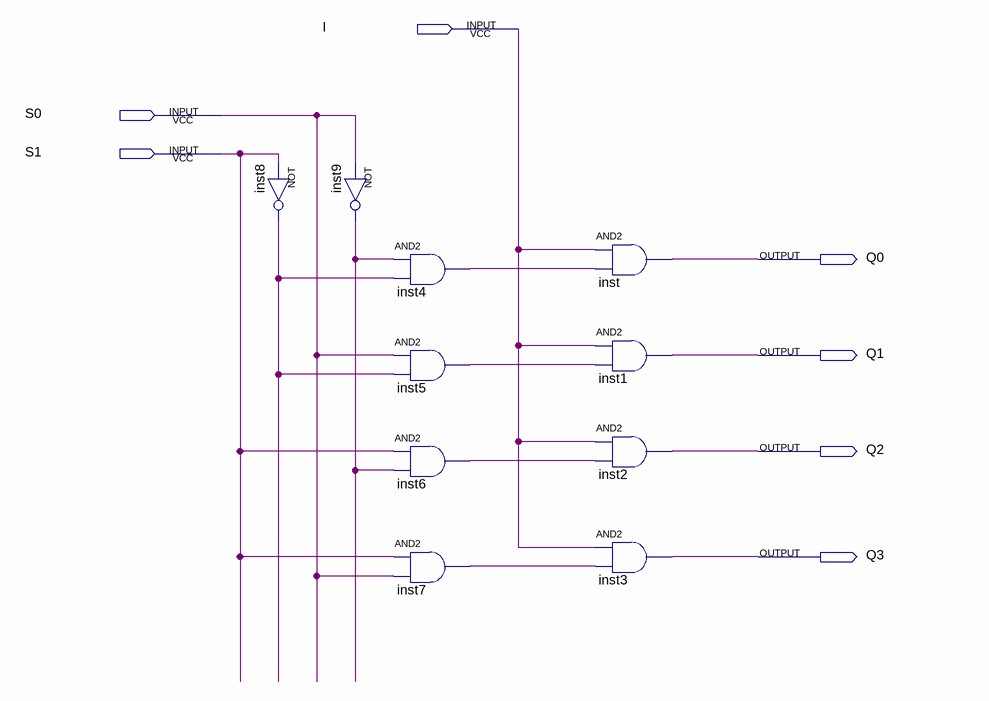
[diagram p0: schematic sheet]
// Quartus schematic ex05_04.bdf as structural Verilog: 10 symbols, 7 pins
module ex05_04 (
  input  I,
  input  S0,
  input  S1,
  output Q0,
  output Q1,
  output Q2,
  output Q3
);

  wire inst4_out, inst5_out, inst6_out, inst7_out, inst8_out, inst9_out;

  not inst8 (inst8_out, S1);
  not inst9 (inst9_out, S0);
  and inst4 (inst4_out, inst9_out, inst8_out);
  and inst5 (inst5_out, S0, inst8_out);
  and inst6 (inst6_out, S1, inst9_out);
  and inst7 (inst7_out, S1, S0);
  and inst (Q0, I, inst4_out);
  and inst1 (Q1, I, inst5_out);
  and inst2 (Q2, I, inst6_out);
  and inst3 (Q3, I, inst7_out);
endmodule
